# Altium schematic sheet 原理图.SchDoc
size A3
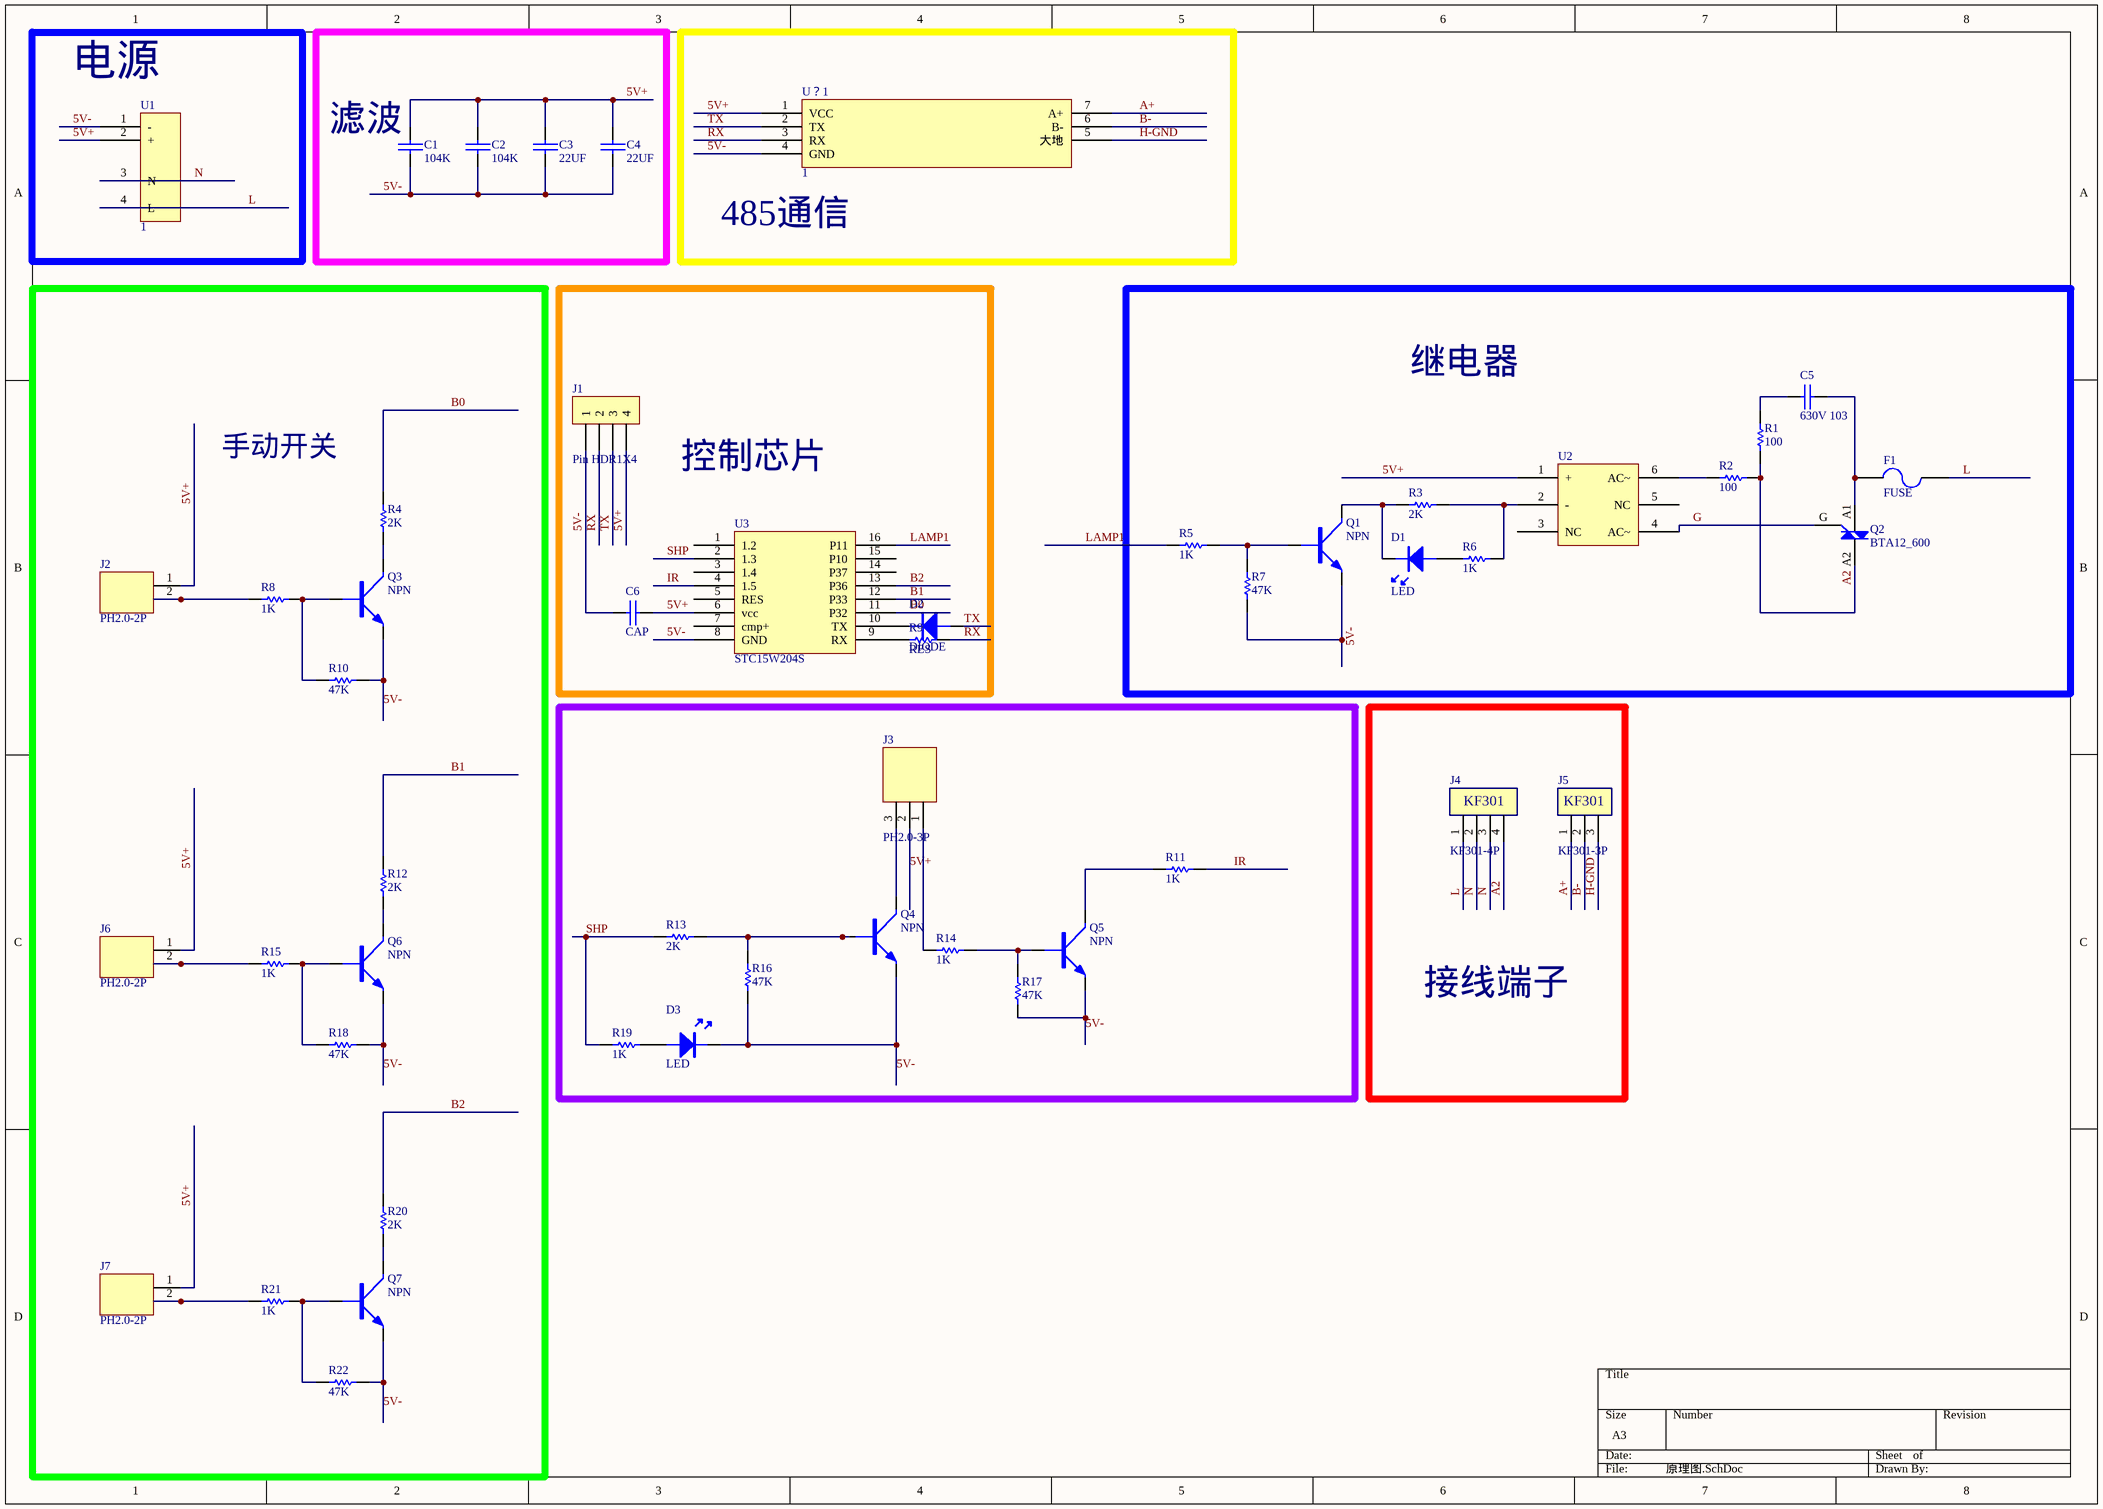
[diagram p0: 原理图.SchDoc]

## Parts
C1  104K  [0603C]
C2  104K  [0603C]
C3  22UF  [0603C]
C4  22UF  [0603C]
C5  630V 103  [RAD-0.3]
C6  CAP  [0603C]
D1  LED  [LED-0603G]
D2  DIODE  [SOD-523]
D3  LED  [LED-0603G]
F1  FUSE  [FUSE-4x16]
J1  Pin HDR1X4  [MHDR1X4]
J2  PH2.0-2P  [PH2.0-2P]
J3  PH2.0-3P  [PH2.0-3P]
J4  KF301-4P  [KF301-5.0-4P]
J5  KF301-3P  [KF301-5.0-3P]
J6  PH2.0-2P  [PH2.0-2P]
J7  PH2.0-2P  [PH2.0-2P]
Q1  NPN  [SOT-23]
Q2  BTA12_600  [TO220A]
Q3  NPN  [SOT-23]
Q4  NPN  [SOT-23]
Q5  NPN  [SOT-23]
Q6  NPN  [SOT-23]
Q7  NPN  [SOT-23]
R1  100  [AXIAL0.4]
R2  100  [AXIAL0.4]
R3  2K  [0402R]
R4  2K  [0402R]
R5  1K  [0402R]
R6  1K  [0402R]
R7  47K  [0402R]
R8  1K  [0402R]
R9  RES  [0402R]
R10  47K  [0402R]
R11  1K  [0402R]
R12  2K  [0402R]
R13  2K  [0402R]
R14  1K  [0402R]
R15  1K  [0402R]
R16  47K  [0402R]
R17  47K  [0402R]
R18  47K  [0402R]
R19  1K  [0402R]
R20  2K  [0402R]
R21  1K  [0402R]
R22  47K  [0402R]
U1  1  [开关电路]
U2  (no value)  [DIP6]
U3  STC15W204S  [SOP16]
U？1  1  [485通信模块]

## Blocks framed on the sheet
电源: U1
滤波: C1-C4
485通信: U？1
手动开关: J2 J6 J7 Q3 Q6 Q7 R4 R8 R10 R12 R15 R18 R20-R22
控制芯片: C6 D2 J1 R9 U3
继电器: C5 D1 F1 Q1 Q2 R1-R3 R5-R7 U2
接线端子: J4 J5

## Nets
5V+: C1.2 C2.2 C3.2 C4.2 C6.2 J1.4 J2.1 J3.2 J6.1 J7.1 U1.2(+) U2.1(+) U3.6(vcc) U？1.1(VCC)
5V-: C1.1 C2.1 C3.1 C4.1 C6.1 D3.K J1.1 Q1.E Q3.E Q4.E Q5.E Q6.E Q7.E R7.1 R10.2 R16.1 R17.1 R18.2 R22.2 U1.1(-) U3.8(GND) U？1.4(GND)
A2: J4.4 Q2.A2 R1.1 R2.2
A+: J5.1 U？1.7(A+)
B0: R4.2 U3.11(P32)
B1: R12.2 U3.12(P33)
B2: R20.2 U3.13(P36)
B-: J5.2 U？1.6(B-)
G: Q2.G U2.4(AC~)
H-GND: J5.3 U？1.5(大地)
IR: R11.2 U3.4(1.5)
L: F1.2 J4.1 U1.4(L)
LAMP1: R5.1 U3.16(P11)
N: J4.2 J4.3 U1.3(N)
RX: J1.2 R9.2 U？1.3(RX)
SHP: R13.1 R19.1 U3.2(1.3)
TX: D2.A J1.3 U？1.2(TX)
NetC5_1: C5.1 R1.2
NetC5_2: C5.2 F1.1 Q2.A1
NetD1_A: D1.A R6.1
NetD1_K: D1.K Q1.C R3.1
NetD2_K: D2.K U3.10(TX)
NetD3_A: D3.A R19.2
NetJ2_2: J2.2 R8.1
NetJ3_1: J3.1 R14.2
NetJ3_3: J3.3 Q4.C
NetJ6_2: J6.2 R15.1
NetJ7_2: J7.2 R21.1
NetQ1_B: Q1.B R5.2 R7.2
NetQ3_B: Q3.B R8.2 R10.1
NetQ3_C: Q3.C R4.1
NetQ4_B: Q4.B R13.2 R16.2
NetQ5_B: Q5.B R14.1 R17.2
NetQ5_C: Q5.C R11.1
NetQ6_B: Q6.B R15.2 R18.1
NetQ6_C: Q6.C R12.1
NetQ7_B: Q7.B R21.2 R22.1
NetQ7_C: Q7.C R20.1
NetR2_1: R2.1 U2.6(AC~)
NetR3_2: R3.2 R6.2 U2.2(-)
NetR9_1: R9.1 U3.9(RX)

Not connected (* = marked no-connect by the designer): U2 3(NC) 5(NC); U3 1(1.2) 3(1.4) 5(RES) 7(cmp+) 14(P37) 15(P10)

## Notes on the sheet
- (in symbol KF301-3P) KF301
- (in symbol KF301-4P) KF301

## Library data of the parts
C1-C6 = CAP: 无极性电容
D2 = DIODE: 普通二极管
Q1 Q3-Q7 = NPN: NPN三极管
Q2 = BTA12_600: 双向可控硅
R1-R8 R10-R22 = RES
U1 = 220TO5V-power
U2 = Component_1
U？1 = 485通信模块